# Altium schematic sheet Sheet1.SchDoc
size A4
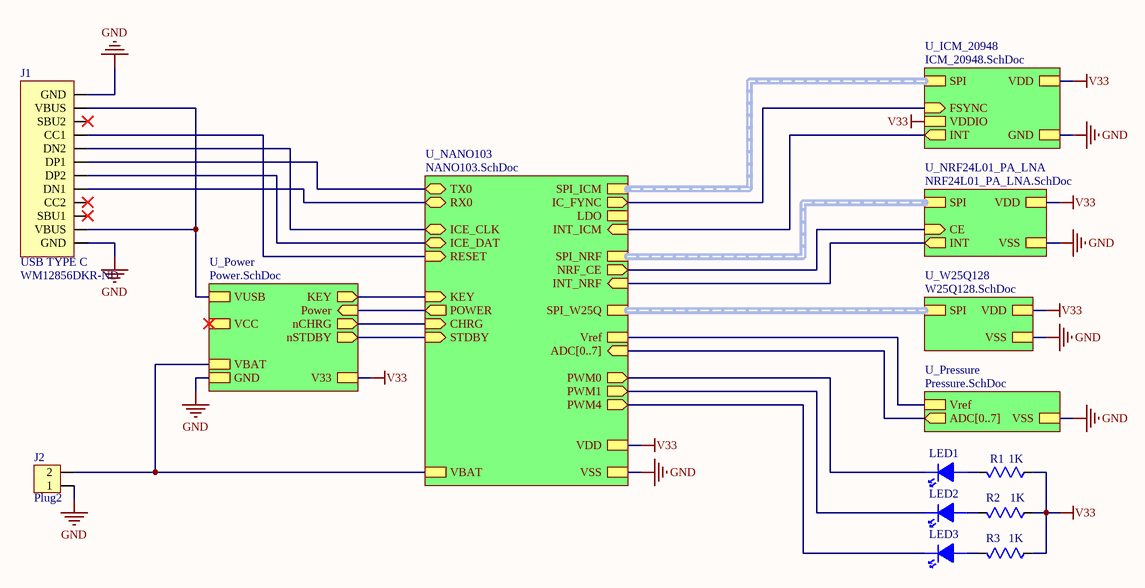
[diagram p0: Sheet1.SchDoc]

## Parts
J1  USB TYPE C  Supplier Part Number 1: WM12856DKR-ND  [USBC-SMD16F]
J2  Plug2  [Terminal_block_2pin_1.25mm_SMD]
LED1  LED  [SMD-0603_LED]  (value not drawn)
LED2  LED  [SMD-0603_LED]  (value not drawn)
LED3  LED  [SMD-0603_LED]  (value not drawn)
R1  value 1K  [RES_0402]  (hidden comment: Res)
R2  value 1K  [RES_0402]  (hidden comment: Res)
R3  value 1K  [RES_0402]  (hidden comment: Res)

## Sub-sheets
U_ICM_20948 = ICM_20948.SchDoc: GND, INT (out), FSYNC (in), VDD, VDDIO, SPI (harness SPI)
U_NANO103 = NANO103.SchDoc: ADC[0..7] (in), SPI_ICM (harness SPI), SPI_W25Q (harness SPI), SPI_NRF (harness SPI), INT_ICM (in), INT_NRF (in), CHRG (in), STDBY (in), KEY (in), POWER (out), TX0 (bidir), RX0 (bidir), PWM0 (out), PWM1 (out), PWM4 (out), Vref, VDD, VSS, RESET (in), NRF_CE (out), ICE_CLK (bidir), ICE_DAT (bidir), LDO, VBAT, IC_FYNC (out)
U_NRF24L01_PA_LNA = NRF24L01_PA_LNA.SchDoc: VDD, VSS, INT (out), CE (in), SPI (harness SPI)
U_Power = Power.SchDoc: VCC, KEY (out), GND, Power (in), V33, VUSB, nCHRG (out), nSTDBY (out), VBAT
U_Pressure = Pressure.SchDoc: VSS, ADC[0..7] (out), Vref
U_W25Q128 = W25Q128.SchDoc: SPI (harness SPI), VDD, VSS

## Nets
GND: J1.1(GND) J1.12(GND) J2.1 ; sheet U_Power/GND, sheet U_W25Q128/VSS, sheet U_ICM_20948/GND, sheet U_NRF24L01_PA_LNA/VSS, sheet U_NANO103/VSS, sheet U_Pressure/VSS
V33: R1.2 R2.2 R3.2 ; sheet U_Power/V33, sheet U_W25Q128/VDD, sheet U_ICM_20948/VDD, sheet U_ICM_20948/VDDIO, sheet U_NRF24L01_PA_LNA/VDD, sheet U_NANO103/VDD
NetJ1_2: J1.2(VBUS) J1.11(VBUS) ; sheet U_Power/VUSB
NetJ1_4: J1.4(CC1) ; sheet U_NANO103/RESET
NetJ1_5: J1.5(DN2) ; sheet U_NANO103/ICE_CLK
NetJ1_6: J1.6(DP1) ; sheet U_NANO103/TX0
NetJ1_7: J1.7(DP2) ; sheet U_NANO103/ICE_DAT
NetJ1_8: J1.8(DN1) ; sheet U_NANO103/RX0
NetJ2_2: J2.2 ; sheet U_Power/VBAT, sheet U_NANO103/VBAT
NetLED1_1: LED1.1 R1.1
NetLED1_2: LED1.2 ; sheet U_NANO103/PWM0
NetLED2_1: LED2.1 R2.1
NetLED2_2: LED2.2 ; sheet U_NANO103/PWM1
NetLED3_1: LED3.1 R3.1
NetLED3_2: LED3.2 ; sheet U_NANO103/PWM4
(unnamed): sheet U_Power/KEY, sheet U_NANO103/KEY
(unnamed): sheet U_Power/Power, sheet U_NANO103/POWER
(unnamed): sheet U_Power/nCHRG, sheet U_NANO103/CHRG
(unnamed): sheet U_Power/nSTDBY, sheet U_NANO103/STDBY
(unnamed): sheet U_ICM_20948/INT, sheet U_NANO103/INT_ICM
(unnamed): sheet U_ICM_20948/FSYNC, sheet U_NANO103/IC_FYNC
(unnamed): sheet U_NRF24L01_PA_LNA/INT, sheet U_NANO103/INT_NRF
(unnamed): sheet U_NRF24L01_PA_LNA/CE, sheet U_NANO103/NRF_CE
(unnamed): sheet U_NANO103/Vref, sheet U_Pressure/Vref

Not connected (* = marked no-connect by the designer): J1 3(SBU2)* 9(CC2)* 10(SBU1)*

## Buses and harness runs
bus sheet U_NANO103/ADC[0..7] = sheet U_Pressure/ADC[0..7]
harness sheet U_ICM_20948/SPI = sheet U_NANO103/SPI_ICM
harness sheet U_NANO103/SPI_NRF = sheet U_NRF24L01_PA_LNA/SPI
harness sheet U_NANO103/SPI_W25Q = sheet U_W25Q128/SPI

## Library data of the parts
J1 = USB TYPE C: USB Shielded I/O Receptacle; Type C; Right Angle; Surface Mount; Gold over Nickel; Manufacturer: Molex; Manufacturer Part Number: 105450-0101; Number of Contacts: 24; Current Rating: 5A; Mating Cycles: 10000; USB Standard: USB 3.1; Number of Ports: 1; Pitch: 0.5mm; Supplier 1: Digi-Key; RoHS: Yes; Category: Connectors; Stock 1: 21711; Pricing 1: 1=2.15000, 10=1.94900, 25=1.82960, 50=1.75000, 100=1.67050, 250=1.51140, 500=1.39208 (USD); Mount: Surface Mount,Through Hole,Horizontal; Case/Package: 0101; Number of Pins: 24; Contact Plating: Gold; Contact Material: Copper Alloy; Housing Material: Thermoplastic; Insulation Color: Black; Number of Terminals: 24; Min Operating Temperature: -30°C; Max Operating Temperature: 85°C; Packaging: Tape and Reel; Gender: Receptacle; Connector Type: USB; Orientation: Right Angle; Termination: Solder; Shielding: Shielded; Features: Shielded; Length: 8.94mm; REACH SVHC: Unknown; Flammability Rating: UL94 V-0; ComponentLink1URL: http://www.farnell.com/datasheets/2801634.pdf?src-supplier=Farnell; ComponentLink1Description: http://www.farnell.com/datasheets/2801634.pdf?src-supplier=Farnell; ComponentLink2URL: http://www.farnell.com/datasheets/2672741.pdf?src-supplier=Newark; ComponentLink2Description: http://www.farnell.com/datasheets/2672741.pdf?src-supplier=Newark; ComponentLink3URL: http://www.farnell.com/datasheets/2015275.pdf?src-supplier=Element14; ComponentLink3Description: http://www.farnell.com/datasheets/2015275.pdf?src-supplier=Element14; ComponentLink4URL: https://www.molex.com/pdm_docs/ps/PS-105448-001.pdf?src-supplier=Digi-Key; ComponentLink4Description: https://www.molex.com/pdm_docs/ps/PS-105448-001.pdf?src-supplier=Digi-Key; ComponentLink5URL: http://www.farnell.com/datasheets/2801634.pdf?src-supplier=Newark; ComponentLink5Description: http://www.farnell.com/datasheets/2801634.pdf?src-supplier=Newark; ComponentLink6URL: https://www.molex.com/pdm_docs/sd/1054500101_sd.pdf?src-supplier=Digi-Key; ComponentLink6Description: https://www.molex.com/pdm_docs/sd/1054500101_sd.pdf?src-supplier=Digi-Key; ComponentLink7URL: http://www.farnell.com/datasheets/2801634.pdf?src-supplier=Element14; ComponentLink7Description: http://www.farnell.com/datasheets/2801634.pdf?src-supplier=Element14; ComponentLink8URL: http://www.literature.molex.com/SQLImages/kelmscott/Molex/PDF_Images/987651-4081.PDF?src-supplier=Avnet; ComponentLink8Description: http://www.literature.molex.com/SQLImages/kelmscott/Molex/PDF_Images/987651-4081.PDF?src-supplier=Avnet; ComponentLink9URL: http://www.literature.molex.com/SQLImages/kelmscott/Molex/PDF_Images/987651-4081.PDF?src-supplier=Avnet+Asia; ComponentLink9Description: http://www.literature.molex.com/SQLImages/kelmscott/Molex/PDF_Images/987651-4081.PDF?src-supplier=Avnet+Asia